# Altium schematic sheet MCU_144_POWER.SchDoc: MCU 144 POWER
size A4; Date: Not used; ApprovedBy: Not used; CheckedBy: Not used; Author: Not used; CompanyName: STMicroelectronics; DrawnBy: Not used; Engineer: Not used; Organization: Not used; Address1: Not used; Address2: Not used; Address3: Not used; Address4: Not used; DocumentNumber: 4; Revision: Not used; SheetNumber: 4; SheetTotal: 9; CurrentTime: Not used; CurrentDate: Not used; Time: Not used; DocumentFullPathAndName: Not used; DocumentName: Not used; ModifiedDate: Not used; ImagePath: Not used; ProjectName: Not used; Application_BuildNumber: Not used
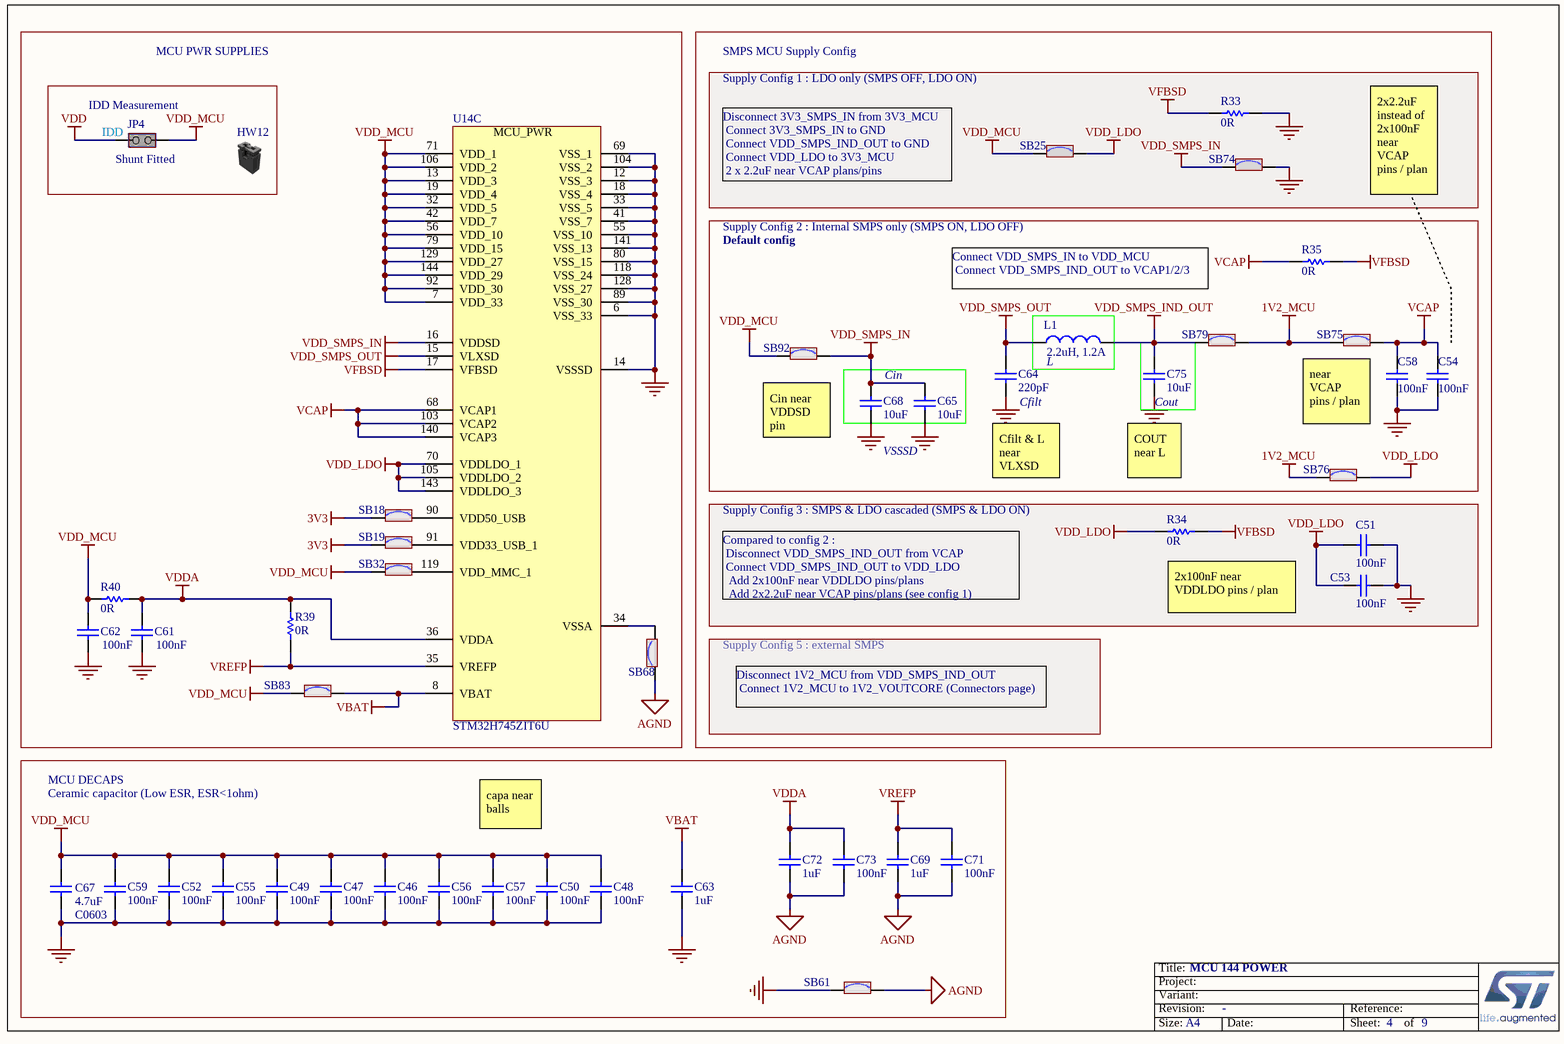
[diagram p0: MCU_144_POWER.SchDoc]

## Parts
C46  value 100nF  [C0402]  (hidden comment: Capacitor)
C47  value 100nF  [C0402]  (hidden comment: Capacitor)
C48  value 100nF  [C0402]  (hidden comment: Capacitor)
C49  value 100nF  [C0402]  (hidden comment: Capacitor)
C50  value 100nF  [C0402]  (hidden comment: Capacitor)
C51  value 100nF  [C0402]  (hidden comment: Capacitor)
C52  value 100nF  [C0402]  (hidden comment: Capacitor)
C53  value 100nF  [C0402]  (hidden comment: Capacitor)
C54  value 100nF  [C0402]  (hidden comment: Capacitor)
C55  value 100nF  [C0402]  (hidden comment: Capacitor)
C56  value 100nF  [C0402]  (hidden comment: Capacitor)
C57  value 100nF  [C0402]  (hidden comment: Capacitor)
C58  value 100nF  [C0402]  (hidden comment: Capacitor)
C59  value 100nF  [C0402]  (hidden comment: Capacitor)
C61  value 100nF  [C0402]  (hidden comment: Capacitor)
C62  value 100nF  [C0402]  (hidden comment: Capacitor)
C63  value 1uF  [C0603]  (hidden comment: Capacitor)
C64  value 220pF  [C0402]  (hidden comment: Capacitor)
C65  value 10uF  [C0402]  (hidden comment: Capacitor)
C67  value 4.7uF  [C0603]  (hidden comment: Capacitor)
C68  value 10uF  [C0402]  (hidden comment: Capacitor)
C69  value 1uF  [C0603]  (hidden comment: Capacitor)
C71  value 100nF  [C0402]  (hidden comment: Capacitor)
C72  value 1uF  [C0603]  (hidden comment: Capacitor)
C73  value 100nF  [C0402]  (hidden comment: Capacitor)
C75  value 10uF  [C0603]  (hidden comment: Capacitor)
HW12  Shunt Black 2.54mm  (value not drawn)  (mechanical)
JP4  value Shunt Fitted  [CON_SAMTEC_TSW-102-07-G-S]  (hidden comment: Jumper_Header 2x1 Fitted)
L1  value 2.2uH, 1.2A  [L0805_H0P9]  (hidden comment: Inductor)
R33  value 0R  [R0402]  (hidden comment: Resistor)
R34  value 0R  [R0402]  (hidden comment: Resistor)
R35  value 0R  [R0402]  (hidden comment: Resistor)
R39  value 0R  [R0603]  (hidden comment: Resistor)
R40  value 0R  [R0603]  (hidden comment: Resistor)
SB18  SB_ON  [SOLDER-BRIDGE_R0603-0R]  (value not drawn)
SB19  SB_ON  [SOLDER-BRIDGE_R0603-0R]  (value not drawn)
SB25  SB_ON  [SOLDER-BRIDGE_R0603-0R]  (value not drawn)
SB32  SB_ON  [SOLDER-BRIDGE_R0603-0R]  (value not drawn)
SB61  SB_ON  [SOLDER-BRIDGE_R0603-0R]  (value not drawn)
SB68  SB_ON  [SOLDER-BRIDGE_R0603-0R]  (value not drawn)
SB74  SB_ON  [SOLDER-BRIDGE_R0603-0R]  (value not drawn)
SB75  SB_ON  [SOLDER-BRIDGE_R0603-0R]  (value not drawn)
SB76  SB_ON  [SOLDER-BRIDGE_R0603-0R]  (value not drawn)
SB79  SB_ON  [SOLDER-BRIDGE_R0603-0R]  (value not drawn)
SB83  SB_ON  [SOLDER-BRIDGE_R0603-0R]  (value not drawn)
SB92  SB_ON  [SOLDER-BRIDGE_R0603-0R]  (value not drawn)
U14  value STM32H745ZIT6U  [ICC_LQFP144_20X20_P050_SOCKET_YAMAICHI_IC149-144-145-B5_NM]  (hidden comment: STM32H7_LQFP144_SMPS)  (part C of 3)

## Blocks framed on the sheet
L: L1
Cout: C75
Cin: C65 C68
Supply Config 3 : SMPS & LDO cascaded (SMPS & LDO ON): C51 C53 R34

## Nets
1V2_MCU: SB75.2 SB76.2 SB79.1
3V3: SB18.2 SB19.2
AGND: C69.2 C71.1 C72.2 C73.1 SB61.2 SB68.1
GND: C46.1 C47.1 C48.1 C49.1 C50.1 C51.2 C52.1 C53.2 C54.1 C55.1 C56.1 C57.1 C58.1 C59.1 C61.2 C62.2 C63.1 C64.1 C65.1 C67.1 C68.1 C75.1 R33.2 SB61.1 SB74.1 U14.6(VSS_33) U14.12(VSS_3) U14.14(VSSSD) U14.18(VSS_4) U14.33(VSS_5) U14.41(VSS_7) U14.55(VSS_10) U14.69(VSS_1) U14.80(VSS_15) U14.89(VSS_30) U14.104(VSS_2) U14.118(VSS_24) U14.128(VSS_27) U14.141(VSS_13)
VBAT: C63.2 SB83.2 U14.8(VBAT)
VCAP: C54.2 C58.2 R35.1 SB75.1 U14.68(VCAP1) U14.103(VCAP2) U14.140(VCAP3)
VDD: JP4.1(COMMON)
VDD_LDO: C51.1 C53.1 R34.1 SB25.1 SB76.1 U14.70(VDDLDO_1) U14.105(VDDLDO_2) U14.143(VDDLDO_3)
VDD_MCU: C46.2 C47.2 C48.2 C49.2 C50.2 C52.2 C55.2 C56.2 C57.2 C59.2 C62.1 C67.2 JP4.2(NO) R40.1 SB25.2 SB32.2 SB83.1 SB92.2 U14.7(VDD_33) U14.13(VDD_3) U14.19(VDD_4) U14.32(VDD_5) U14.42(VDD_7) U14.56(VDD_10) U14.71(VDD_1) U14.79(VDD_15) U14.92(VDD_30) U14.106(VDD_2) U14.129(VDD_27) U14.144(VDD_29)
VDD_SMPS_IN: C65.2 C68.2 SB74.2 SB92.1 U14.16(VDDSD)
VDD_SMPS_IND_OUT: C75.2 L1.2 SB79.2
VDD_SMPS_OUT: C64.2 L1.1 U14.15(VLXSD)
VDDA: C61.1 C72.1 C73.2 R39.1 R40.2 U14.36(VDDA)
VFBSD: R33.1 R34.2 R35.2 U14.17(VFBSD)
VREFP: C69.1 C71.2 R39.2 U14.35(VREFP)
NetSB18_1: SB18.1 U14.90(VDD50_USB)
NetSB19_1: SB19.1 U14.91(VDD33_USB_1)
NetSB32_1: SB32.1 U14.119(VDD_MMC_1)
NetSB68_2: SB68.2 U14.34(VSSA)

## Notes on the sheet
- (near JP4) IDD Measurement
- MCU PWR SUPPLIES
- SMPS MCU Supply Config
- Supply Config 1 : LDO only (SMPS OFF, LDO ON)
- (near JP4) IDD
- Disconnect 3V3_SMPS_IN from 3V3_MCU
  Connect 3V3_SMPS_IN to GND
  Connect VDD_SMPS_IND_OUT to GND
  Connect VDD_LDO to 3V3_MCU
  2 x 2.2uF near VCAP plans/pins
- Default config
- Supply Config 2 : Internal SMPS only (SMPS ON, LDO OFF)
- 2x2.2uF instead of 2x100nF near VCAP pins / plan
- Connect VDD_SMPS_IN to VDD_MCU
  Connect VDD_SMPS_IND_OUT to VCAP1/2/3
- Cin near VDDSD pin
- (near C64) Cfilt
- near VCAP pins / plan
- VSSSD
- (near C64) Cfilt & L near VLXSD pin
- COUT near L
- Supply Config 5 : external SMPS
- Compared to config 2 :
  Disconnect VDD_SMPS_IND_OUT from VCAP
  Connect VDD_SMPS_IND_OUT to VDD_LDO
  Add 2x100nF near VDDLDO pins/plans
  Add 2x2.2uF near VCAP pins/plans (see config 1)
- (near R34) 2x100nF near VDDLDO pins / plan
- Disconnect 1V2_MCU from VDD_SMPS_IND_OUT
  Connect 1V2_MCU to 1V2_VOUTCORE (Connectors page)
- MCU DECAPS
- Ceramic capacitor (Low ESR, ESR<1ohm)
- capa near balls
- Title:
- Project:
- Size:
- Revision:
- Variant:
- A4
- -
- Date:
- Reference:
- Sheet:
- of
- (in symbol MCD-01401, part C) MCU_PWR

## Library data of the parts
C46-C59 C61 C62 C71 C73 = MCD-00006: Capacitor, MLCC, 100nF, 16V, X7R, 10%, 0402, T=0.5mm; Manufacturer_Part_Number: CC0402KRX7R7BB104; Manufacturer: YAGEO; Alternate_Manufacturer_Part_Number: GCM155R71C104KA55D; Alternate_Manufacturer: MURATA; Provided_By: SUBCO; ECCN_US: EAR99; ECCN_EU: NEC; Internal_Part_Number: MCD-00006; Status: Released; Part_Type: Capacitor; Package: C0402; ComponentLink1Description: Datasheet; ComponentLink1URL: http://tunmcdsvn.tun.st.com/Component_Datasheet_Library/Trunk/Capacitors/Yageo_Multilayer_Capacitor_X7R_series_100pF_to_22uF
C63 C69 C72 = MCD-00238: Capacitor, MLCC, 1uF, 6V3, X5R, 10%, 0603, T=0,8mm; Manufacturer_Part_Number: CC0603KRX5R5BB105; Manufacturer: YAGEO; Provided_By: SUBCO; ECCN_US: EAR99; ECCN_EU: NEC; Internal_Part_Number: MCD-00238; Status: Released; Part_Type: Capacitor; Package: C0603; ComponentLink1Description: Datasheet; ComponentLink1URL: http://tunmcdsvn.tun.st.com/Component_Datasheet_Library/Trunk/Capacitors/Yageo_Multilayer_capacitor_X5R_series_100pF_to_100uF
C64 = MCD-01225: Capacitor, MLCC, 220pF, 50V, NPO, 5%, 0402, T=0,5mm; Manufacturer_Part_Number: CC0402JRNPO9BN221; Manufacturer: YAGEO; Provided_By: SUBCO; Internal_Part_Number: MCD-01225; Status: Released; Part_Type: Capacitor; Package: C0402; ComponentLink1Description: Datasheet; ComponentLink1URL: http://tunmcdsvn.tun.st.com/Component_Datasheet_Library/Trunk/Capacitors/Yageo_Capacitor_NP0_16V-to-50V; ECCN_US: N/A; ECCN_EU: N/A
C65 C68 = MCD-01716: Capacitor, MLCC, 10uF, 6V3, X5R, 20%, 0402, T=0.5mm; Manufacturer_Part_Number: CC0402MRX5R5BB106; Manufacturer: YAGEO; Provided_By: SUBCO; Internal_Part_Number: MCD-01716; Status: Released; Part_Type: Capacitor; Package: C0402; ComponentLink1Description: Datasheet; ComponentLink1URL: http://tunmcdsvn.tun.st.com/Component_Datasheet_Library/Trunk/Capacitors/Yageo_Multilayer_capacitor_X5R_series_100pF_to_100uF/Yageo_Multilayer_capacitor_X5R_100pF_to_100uF.pdf; ECCN_US: N/A; ECCN_EU: N/A
C67 = MCD-01121: Capacitor, MLCC, 4.7µF, 10V, X5R, 20%, 0603, T=0,8mm; Manufacturer_Part_Number: GRM188R61A475ME15; Manufacturer: MURATA; Provided_By: SUBCO; ECCN_US: EAR99; ECCN_EU: NEC; Internal_Part_Number: MCD-01121; Status: Released; Part_Type: Capacitor; Package: C0603; ComponentLink1Description: Datasheet; ComponentLink1URL: http://tunmcdsvn.tun.st.com/Component_Datasheet_Library/Trunk/Capacitors/Murata_Capacitor_GR_series
C75 = MCD-01341: Capacitor, MLCC, 10uF, 6V3, X5R, 20%, 0603, T=0,8mm; Manufacturer_Part_Number: GRM188R60J106ME47D; Manufacturer: MURATA; Provided_By: SUBCO; ECCN_US: EAR99; ECCN_EU: NEC; Internal_Part_Number: MCD-01341; Status: Released; Part_Type: Capacitor; Package: C0603; ComponentLink1Description: Datasheet; ComponentLink1URL: http://tunmcdsvn.tun.st.com/Component_Datasheet_Library/Trunk/Capacitors/Murata_Capacitor_GR_series
HW12 = MCD-00043: SHUNT 2.54mm BLACK; Manufacturer_Part_Number: SNT-100-BK-G; Manufacturer: SAMTEC; Part_Type: Mechanical; Alternate_Manufacturer_Part_Number: 316102S111A; Alternate_Manufacturer: JIUBABA; Provided_By: SUBCO; Internal_Part_Number: MCD-00043; ComponentLink1Description: Datasheet; Status: Released; ComponentLink1URL: http://tunmcdsvn.tun.st.com/Component_Datasheet_Library/Trunk/Connectors/Samtec_Shunt_Jumper_SNT100; ECCN_US: n/a; ECCN_EU: n/a
JP4 = MCD-00683: Header, 2x1, 2,54mm, VR, TH, Height 5.84mm/2.54mm - Shunt Fitted by default; Part_Type: Connector; Manufacturer_Part_Number: TSW-102-07-x-S; Manufacturer: SAMTEC; Alternate_Manufacturer_Part_Number: 313102S111116; Alternate_Manufacturer: LIANYI; Provided_By: SUBCO; Internal_Part_Number: MCD-00683; Status: Released; ComponentLink1Description: Datasheet; ComponentLink1URL: http://tunmcdsvn.tun.st.com/Component_Datasheet_Library/Trunk/Connectors/Samtec_TSW-HTSW-series; ECCN_US: n/a; ECCN_EU: n/a
L1 = MCD-01340: Inductor, 2.2uH, 20%, Isat 1.2A, DCR 0.228Ohm, 0805; Manufacturer_Part_Number: DFE201210U-2R2M=P2; Manufacturer: MURATA; Provided_By: SUBCO; Internal_Part_Number: MCD-01340; Status: Released; Part_Type: Inductor; Package: L0805; ComponentLink1Description: Datasheet; ComponentLink1URL: http://tunmcdsvn.tun.st.com/Component_Datasheet_Library/Trunk/Inductors/MURATA_Power_Inductor_2u2H_2012_DFE201210U-2R2M=P2; ECCN_US: n/a; ECCN_EU: n/a
R33-R35 = MCD-00052: Resistor,0R,0402,5%,1/16W; Manufacturer_Part_Number: RC0402JR-070RL; Manufacturer: YAGEO; Provided_By: SUBCO; ECCN_US: EAR99; ECCN_EU: NEC; Internal_Part_Number: MCD-00052; Status: Released; Part_Type: Resistor; Package: R0402; ComponentLink1Description: Datasheet; ComponentLink1URL: http://tunmcdsvn.tun.st.com/Component_Datasheet_Library/Trunk/Resistors/Yageo_Resistor_RC0402-series
R39 R40 = MCD-00056: Resistor,0R,0603,5%,1/10W; Manufacturer_Part_Number: RC0603JR-070RL; Manufacturer: YAGEO; Provided_By: SUBCO; ECCN_US: EAR99; ECCN_EU: NEC; Internal_Part_Number: MCD-00056; ComponentLink1Description: Datasheet; Status: Released; Part_Type: Resistor; ComponentLink1URL: http://tunmcdsvn.tun.st.com/Component_Datasheet_Library/Trunk/Resistors/Yageo_Resistor_RC0603-series; Package: R0603
SB18 SB19 SB25 SB32 SB61 SB68 SB74-SB76 SB79 SB83 SB92 = MCD-00071: Solder Bridge ON; Part_Type: Mechanical; Manufacturer_Part_Number: RC0603JR-070RL; Manufacturer: YAGEO; Provided_By: SUBCO; Internal_Part_Number: MCD-00071; Status: Released; ComponentLink1Description: Datasheet; Package: SB0603; ComponentLink1URL: http://tunmcdsvn.tun.st.com/Component_Datasheet_Library/Trunk/Resistors/Yageo_Resistor_RC0603-series; ECCN_US: n/a; ECCN_EU: n/a
U14 = MCD-01401: STM32H745ZIT6U, LQFP144 package, 20x20, with socket footprint; Part_Type: IC; Manufacturer: STMICROELECTRONICS; BMS_Part_Number: 9175297 (cut 2.0); ECCN_US: 3A991A2; ECCN_EU: NEC; Provided_By: SUBCO with ST control; Internal_Part_Number: MCD-01401; Status: Released; Manufacturer_Part_Number: STM32H745ZIT6U; Package: LQFP144 20x20; ComponentLink1Description: Datasheet; ComponentLink1URL: http://tunmcdsvn.tun.st.com/Component_Datasheet_Library/Trunk/IC/STM_STM32L552ZET6QU